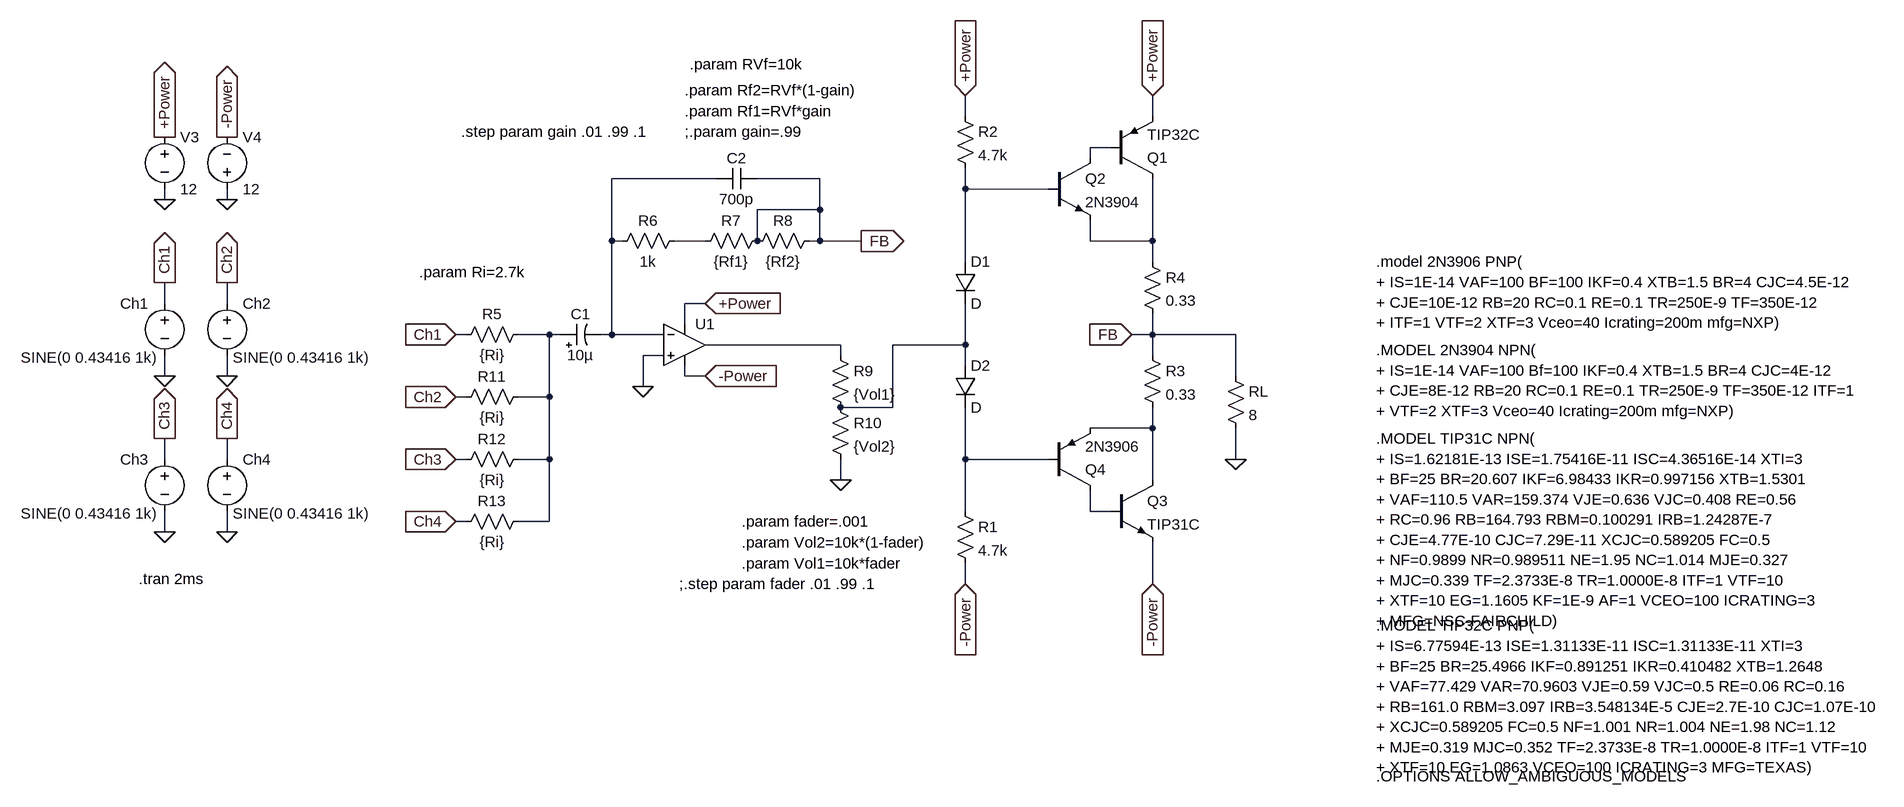
[diagram p0: schematic Class AB & Master Mixer.asc]
Class AB & Master Mixer.asc, the LTspice schematic file:
Version 4.1
SHEET 1 7092 1032
WIRE 496 -288 496 -320
WIRE 784 -288 784 -320
WIRE 720 -240 688 -240
WIRE 688 -224 688 -240
WIRE 112 -192 -48 -192
WIRE 272 -192 176 -192
WIRE 496 -176 496 -208
WIRE 624 -176 496 -176
WIRE -736 -160 -736 -176
WIRE -640 -160 -640 -176
WIRE 272 -144 272 -192
WIRE 272 -144 176 -144
WIRE -48 -96 -48 -192
WIRE -32 -96 -48 -96
WIRE 96 -96 48 -96
WIRE 176 -96 176 -144
WIRE 272 -96 272 -144
WIRE 272 -96 256 -96
WIRE 336 -96 272 -96
WIRE 688 -96 688 -128
WIRE 784 -96 784 -192
WIRE 784 -96 688 -96
WIRE 496 -64 496 -176
WIRE 784 -64 784 -96
WIRE -736 0 -736 -32
WIRE -640 0 -640 -32
WIRE 96 0 64 0
WIRE 64 32 64 0
WIRE -272 48 -288 48
WIRE -144 48 -192 48
WIRE -128 48 -144 48
WIRE -48 48 -48 -96
WIRE -48 48 -64 48
WIRE 32 48 -48 48
WIRE 784 48 784 16
WIRE 784 48 752 48
WIRE 912 48 784 48
WIRE 304 64 96 64
WIRE 496 64 496 0
WIRE 496 64 384 64
WIRE 32 80 0 80
WIRE 304 80 304 64
WIRE 784 80 784 48
WIRE 496 96 496 64
WIRE -736 112 -736 80
WIRE -640 112 -640 80
WIRE 64 112 64 96
WIRE 96 112 64 112
WIRE 912 112 912 48
WIRE 0 128 0 80
WIRE -272 144 -288 144
WIRE -144 144 -144 48
WIRE -144 144 -192 144
WIRE 384 160 384 64
WIRE 384 160 304 160
WIRE 784 192 784 160
WIRE 784 192 688 192
WIRE -736 240 -736 208
WIRE -640 240 -640 208
WIRE -272 240 -288 240
WIRE -144 240 -144 144
WIRE -144 240 -192 240
WIRE 496 240 496 160
WIRE 624 240 496 240
WIRE 912 240 912 192
WIRE 304 272 304 240
WIRE 784 272 784 192
WIRE 496 320 496 240
WIRE 688 320 688 288
WIRE 720 320 688 320
WIRE -272 336 -288 336
WIRE -144 336 -144 240
WIRE -144 336 -192 336
WIRE -736 352 -736 320
WIRE -640 352 -640 320
WIRE 496 432 496 400
WIRE 784 432 784 368
FLAG -640 -256 -Power
IOPIN -640 -256 Out
FLAG -736 -256 +Power
IOPIN -736 -256 Out
FLAG -736 -160 0
FLAG -640 -160 0
FLAG -736 112 0
FLAG -736 -32 Ch1
IOPIN -736 -32 Out
FLAG 496 -320 +Power
IOPIN 496 -320 In
FLAG 784 -320 +Power
IOPIN 784 -320 In
FLAG 784 432 -Power
IOPIN 784 432 In
FLAG 912 240 0
FLAG -288 48 Ch1
IOPIN -288 48 In
FLAG 496 432 -Power
IOPIN 496 432 In
FLAG 0 128 0
FLAG 96 0 +Power
IOPIN 96 0 In
FLAG 96 112 -Power
IOPIN 96 112 In
FLAG 336 -96 FB
IOPIN 336 -96 Out
FLAG 752 48 FB
IOPIN 752 48 In
FLAG 304 272 0
FLAG -288 144 Ch2
IOPIN -288 144 In
FLAG -288 240 Ch3
IOPIN -288 240 In
FLAG -288 336 Ch4
IOPIN -288 336 In
FLAG -640 112 0
FLAG -640 -32 Ch2
IOPIN -640 -32 Out
FLAG -736 352 0
FLAG -736 208 Ch3
IOPIN -736 208 Out
FLAG -640 352 0
FLAG -640 208 Ch4
IOPIN -640 208 Out
SYMBOL voltage -736 -272 R0
WINDOW 123 0 0 Left 0
WINDOW 39 0 0 Left 0
SYMATTR InstName V3
SYMATTR Value 12
SYMBOL voltage -640 -160 M180
WINDOW 0 24 96 Left 2
WINDOW 3 24 16 Left 2
WINDOW 123 0 0 Left 0
WINDOW 39 0 0 Left 0
SYMATTR InstName V4
SYMATTR Value 12
SYMBOL voltage -736 -16 M0
WINDOW 123 0 0 Left 0
WINDOW 39 0 0 Left 0
WINDOW 3 9 99 Left 2
SYMATTR Value SINE(0 0.43416 1k)
SYMATTR InstName Ch1
SYMBOL npn 624 -224 R0
SYMATTR InstName Q2
SYMATTR Value 2N3904
SYMBOL npn 720 272 R0
SYMATTR InstName Q3
SYMATTR Value TIP31C
SYMBOL pnp 624 288 M180
SYMATTR InstName Q4
SYMATTR Value 2N3906
SYMBOL diode 480 -64 R0
SYMATTR InstName D1
SYMBOL diode 480 96 R0
SYMATTR InstName D2
SYMBOL res 480 -304 R0
SYMATTR InstName R2
SYMATTR Value 4.7k
SYMBOL res 896 96 R0
SYMATTR InstName RL
SYMATTR Value 8
SYMBOL res 480 304 R0
SYMATTR InstName R1
SYMATTR Value 4.7k
SYMBOL res 768 64 R0
SYMATTR InstName R3
SYMATTR Value 0.33
SYMBOL res 768 -80 R0
SYMATTR InstName R4
SYMATTR Value 0.33
SYMBOL pnp 720 -192 M180
SYMATTR InstName Q1
SYMATTR Value TIP32C
SYMBOL OpAmps\\UniversalOpAmp 64 64 R0
SYMATTR InstName U1
SYMBOL res -176 32 R90
WINDOW 0 0 56 VBottom 2
WINDOW 3 32 56 VTop 2
SYMATTR InstName R5
SYMATTR Value {Ri}
SYMBOL res 64 -112 R90
WINDOW 0 0 56 VBottom 2
WINDOW 3 32 56 VTop 2
SYMATTR InstName R6
SYMATTR Value 1k
SYMBOL res 192 -112 R90
WINDOW 0 0 56 VBottom 2
WINDOW 3 32 56 VTop 2
SYMATTR InstName R7
SYMATTR Value {Rf1}
SYMBOL res 272 -112 R90
WINDOW 0 0 56 VBottom 2
WINDOW 3 32 56 VTop 2
SYMATTR InstName R8
SYMATTR Value {Rf2}
SYMBOL res 288 64 R0
SYMATTR InstName R9
SYMATTR Value {Vol1}
SYMBOL res 288 144 R0
SYMATTR InstName R10
SYMATTR Value {Vol2}
SYMBOL res -176 128 R90
WINDOW 0 0 56 VBottom 2
WINDOW 3 32 56 VTop 2
SYMATTR InstName R11
SYMATTR Value {Ri}
SYMBOL res -176 224 R90
WINDOW 0 0 56 VBottom 2
WINDOW 3 32 56 VTop 2
SYMATTR InstName R12
SYMATTR Value {Ri}
SYMBOL res -176 320 R90
WINDOW 0 0 56 VBottom 2
WINDOW 3 32 56 VTop 2
SYMATTR InstName R13
SYMATTR Value {Ri}
SYMBOL voltage -640 -16 R0
WINDOW 123 0 0 Left 0
WINDOW 39 0 0 Left 0
WINDOW 3 9 99 Left 2
SYMATTR Value SINE(0 0.43416 1k)
SYMATTR InstName Ch2
SYMBOL voltage -736 224 M0
WINDOW 123 0 0 Left 0
WINDOW 39 0 0 Left 0
WINDOW 3 9 99 Left 2
SYMATTR Value SINE(0 0.43416 1k)
SYMATTR InstName Ch3
SYMBOL voltage -640 224 R0
WINDOW 123 0 0 Left 0
WINDOW 39 0 0 Left 0
WINDOW 3 9 99 Left 2
SYMATTR Value SINE(0 0.43416 1k)
SYMATTR InstName Ch4
SYMBOL polcap -128 64 R270
WINDOW 0 32 32 VTop 2
WINDOW 3 0 32 VBottom 2
SYMATTR InstName C1
SYMATTR Value 10µ
SYMBOL cap 176 -208 R90
WINDOW 0 0 32 VBottom 2
WINDOW 3 32 32 VTop 2
SYMATTR InstName C2
SYMATTR Value 700p
TEXT -776 424 Left 2 !.tran 2ms
TEXT 1128 72 Left 2 !.MODEL 2N3904 NPN(\n+ IS=1E-14 VAF=100 Bf=100 IKF=0.4 XTB=1.5 BR=4 CJC=4E-12\n+ CJE=8E-12 RB=20 RC=0.1 RE=0.1 TR=250E-9 TF=350E-12 ITF=1\n+ VTF=2 XTF=3 Vceo=40 Icrating=200m mfg=NXP)
TEXT 1128 208 Left 2 !.MODEL TIP31C NPN(\n+ IS=1.62181E-13 ISE=1.75416E-11 ISC=4.36516E-14 XTI=3\n+ BF=25 BR=20.607 IKF=6.98433 IKR=0.997156 XTB=1.5301\n+ VAF=110.5 VAR=159.374 VJE=0.636 VJC=0.408 RE=0.56\n+ RC=0.96 RB=164.793 RBM=0.100291 IRB=1.24287E-7\n+ CJE=4.77E-10 CJC=7.29E-11 XCJC=0.589205 FC=0.5\n+ NF=0.9899 NR=0.989511 NE=1.95 NC=1.014 MJE=0.327\n+ MJC=0.339 TF=2.3733E-8 TR=1.0000E-8 ITF=1 VTF=10\n+ XTF=10 EG=1.1605 KF=1E-9 AF=1 VCEO=100 ICRATING=3\n+ MFG=NSC-FAIRCHILD)
TEXT 1128 -64 Left 2 !.model 2N3906 PNP(\n+ IS=1E-14 VAF=100 BF=100 IKF=0.4 XTB=1.5 BR=4 CJC=4.5E-12\n+ CJE=10E-12 RB=20 RC=0.1 RE=0.1 TR=250E-9 TF=350E-12\n+ ITF=1 VTF=2 XTF=3 Vceo=40 Icrating=200m mfg=NXP)
TEXT 1128 496 Left 2 !.MODEL TIP32C PNP(\n+ IS=6.77594E-13 ISE=1.31133E-11 ISC=1.31133E-11 XTI=3\n+ BF=25 BR=25.4966 IKF=0.891251 IKR=0.410482 XTB=1.2648\n+ VAF=77.429 VAR=70.9603 VJE=0.59 VJC=0.5 RE=0.06 RC=0.16\n+ RB=161.0 RBM=3.097 IRB=3.548134E-5 CJE=2.7E-10 CJC=1.07E-10\n+ XCJC=0.589205 FC=0.5 NF=1.001 NR=1.004 NE=1.98 NC=1.12\n+ MJE=0.319 MJC=0.352 TF=2.3733E-8 TR=1.0000E-8 ITF=1 VTF=10\n+ XTF=10 EG=1.0863 VCEO=100 ICRATING=3 MFG=TEXAS)
TEXT -280 -264 Left 2 !.step param gain .01 .99 .1
TEXT 56 432 Left 2 !;.step param fader .01 .99 .1
TEXT 152 336 Left 2 !.param fader=.001
TEXT 64 -264 Left 2 !;.param gain=.99
TEXT 64 -296 Left 2 !.param Rf1=RVf*gain
TEXT 64 -328 Left 2 !.param Rf2=RVf*(1-gain)
TEXT 152 400 Left 2 !.param Vol1=10k*fader
TEXT 152 368 Left 2 !.param Vol2=10k*(1-fader)
TEXT 1128 728 Left 2 !.OPTIONS ALLOW_AMBIGUOUS_MODELS
TEXT 72 -368 Left 2 !.param RVf=10k
TEXT -344 -48 Left 2 !.param Ri=2.7k

The netlist it stands for:
* Class AB & Master Mixer.asc
V3 +Power 0 12
V4 0 -Power 12
V§Ch1 Ch1 0 SINE(0 0.43416 1k)
Q2 N001 N003 N005 0 2N3904
Q3 N009 N011 -Power 0 TIP31C
Q4 N011 N010 N009 0 2N3906
D1 N003 N008 D
D2 N008 N010 D
R2 +Power N003 4.7k
RL FB 0 8
R1 N010 -Power 4.7k
R3 FB N009 0.33
R4 N005 FB 0.33
Q1 N005 N001 +Power 0 TIP32C
X§U1 0 N002 +Power -Power N007 level1 Avol=1Meg GBW=10Meg Vos=0 En=0 Enk=0 In=0 Ink=0 Rin=500Meg  ; pins In+ In- V+ V- OUT
R5 N006 Ch1 {Ri}
R6 N004 N002 1k
R7 FB N004 {Rf1}
R8 FB FB {Rf2}
R9 N007 N008 {Vol1}
R10 N008 0 {Vol2}
R11 N006 Ch2 {Ri}
R12 N006 Ch3 {Ri}
R13 N006 Ch4 {Ri}
V§Ch2 Ch2 0 SINE(0 0.43416 1k)
V§Ch3 Ch3 0 SINE(0 0.43416 1k)
V§Ch4 Ch4 0 SINE(0 0.43416 1k)
C1 N006 N002 10µ
C2 FB N002 700p
.model D D
.lib standard.dio
.model NPN NPN
.model PNP PNP
.lib standard.bjt
.tran 2ms
.MODEL 2N3904 NPN(
+ IS=1E-14 VAF=100 Bf=100 IKF=0.4 XTB=1.5 BR=4 CJC=4E-12
+ CJE=8E-12 RB=20 RC=0.1 RE=0.1 TR=250E-9 TF=350E-12 ITF=1
+ VTF=2 XTF=3 Vceo=40 Icrating=200m mfg=NXP)
.MODEL TIP31C NPN(
+ IS=1.62181E-13 ISE=1.75416E-11 ISC=4.36516E-14 XTI=3
+ BF=25 BR=20.607 IKF=6.98433 IKR=0.997156 XTB=1.5301
+ VAF=110.5 VAR=159.374 VJE=0.636 VJC=0.408 RE=0.56
+ RC=0.96 RB=164.793 RBM=0.100291 IRB=1.24287E-7
+ CJE=4.77E-10 CJC=7.29E-11 XCJC=0.589205 FC=0.5
+ NF=0.9899 NR=0.989511 NE=1.95 NC=1.014 MJE=0.327
+ MJC=0.339 TF=2.3733E-8 TR=1.0000E-8 ITF=1 VTF=10
+ XTF=10 EG=1.1605 KF=1E-9 AF=1 VCEO=100 ICRATING=3
+ MFG=NSC-FAIRCHILD)
.model 2N3906 PNP(
+ IS=1E-14 VAF=100 BF=100 IKF=0.4 XTB=1.5 BR=4 CJC=4.5E-12
+ CJE=10E-12 RB=20 RC=0.1 RE=0.1 TR=250E-9 TF=350E-12
+ ITF=1 VTF=2 XTF=3 Vceo=40 Icrating=200m mfg=NXP)
.MODEL TIP32C PNP(
+ IS=6.77594E-13 ISE=1.31133E-11 ISC=1.31133E-11 XTI=3
+ BF=25 BR=25.4966 IKF=0.891251 IKR=0.410482 XTB=1.2648
+ VAF=77.429 VAR=70.9603 VJE=0.59 VJC=0.5 RE=0.06 RC=0.16
+ RB=161.0 RBM=3.097 IRB=3.548134E-5 CJE=2.7E-10 CJC=1.07E-10
+ XCJC=0.589205 FC=0.5 NF=1.001 NR=1.004 NE=1.98 NC=1.12
+ MJE=0.319 MJC=0.352 TF=2.3733E-8 TR=1.0000E-8 ITF=1 VTF=10
+ XTF=10 EG=1.0863 VCEO=100 ICRATING=3 MFG=TEXAS)
.step param gain .01 .99 .1
;.step param fader .01 .99 .1
.param fader=.001
;.param gain=.99
.param Rf1=RVf*gain
.param Rf2=RVf*(1-gain)
.param Vol1=10k*fader
.param Vol2=10k*(1-fader)
.OPTIONS ALLOW_AMBIGUOUS_MODELS
.param RVf=10k
.param Ri=2.7k
.lib UniversalOpAmp1.lib
.backanno
.end